# Altium schematic sheet RS232_and_USB_ports.SchDoc: RS232_and_USB_ports
size A4 portrait; Revision: 3.4; SheetNumber: 4; SheetTotal: 23; Date: 18/06/2014; DrawnBy: J. Gabriel R.E.; Organization: Seven Solutions S.L.; Address1: C/Baza, Parcela 19, Nave 3; Address2: Polнgono Ind. Juncaril; Address3: 18210-Peligros-Granada; Address4: Spain; WebAddress: www.sevensols.com; Project: White Rabbit; ProjectName: White Rabbit
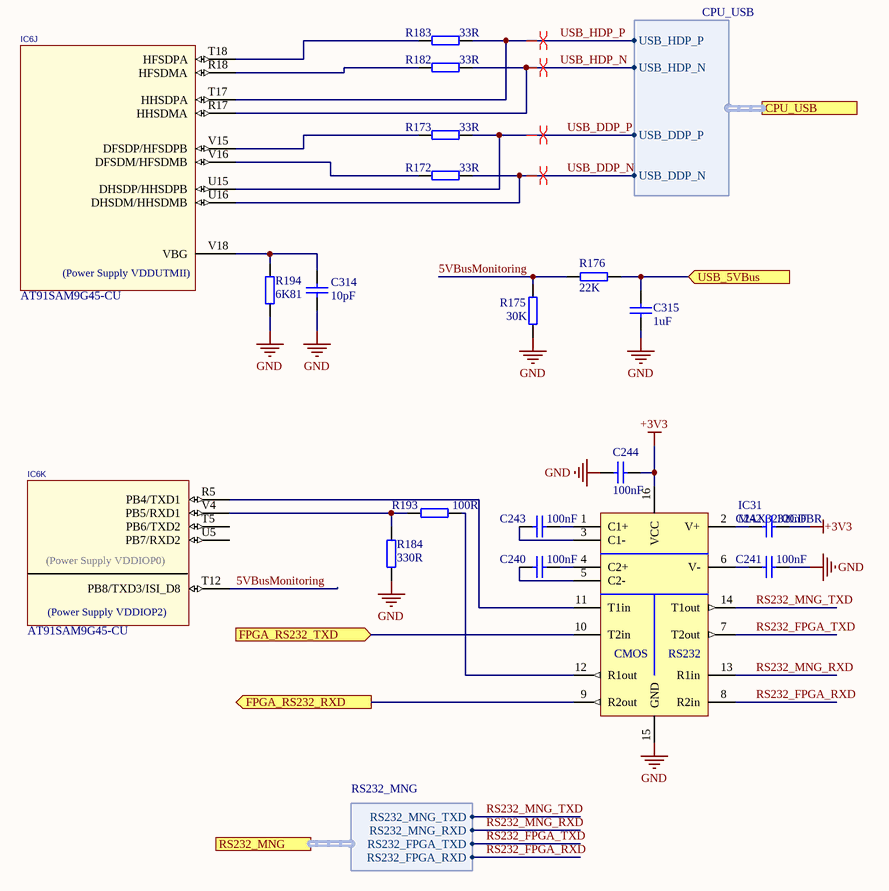
[diagram p0: RS232_and_USB_ports.SchDoc]

## Parts
C240  100nF  [CC1005-0402]
C241  100nF  [CC1005-0402]
C242  100nF  [CC1005-0402]
C243  100nF  [CC1005-0402]
C244  100nF  [CC1005-0402]
C314  10pF  [CC1005-0402]
C315  1uF  [CC1005-0402]
IC6  AT91SAM9G45-CU  [TFBGA324]  (parts J,K of 12)
IC31  MAX3232CDBR  [SOP65P780X200-16N]
R172  33R  [0603]
R173  33R  [0603]
R175  30K  [0402]
R176  22K  [0402]
R182  33R  [0603]
R183  33R  [0603]
R184  330R  [0402]
R193  100R  [0402]
R194  6K81  [0402]

## Ports
CPU_USB (harness CPU_USB), FPGA_RS232_RXD (out), FPGA_RS232_TXD (in), RS232_MNG (harness RS232_MNG), USB_5VBus (in)

## Harnesses
RS232_MNG: RS232_MNG_TXD, RS232_FPGA_TXD, RS232_MNG_RXD, RS232_FPGA_RXD
CPU_USB: USB_HDP_P, USB_HDP_N, USB_DDP_P, USB_DDP_N

## Nets
+3V3: C242.1 C244.1 IC31.16(VCC)
GND: C241.1 C244.2 C314.1 C315.2 IC31.15(GND) R175.1 R184.2 R194.1
5VBusMonitoring: IC6.T12(PB8/TXD3/ISI_D8) R175.2 R176.2
FPGA_RS232_RXD: IC31.9(R2out) ; port FPGA_RS232_RXD
FPGA_RS232_TXD: IC31.10(T2in) ; port FPGA_RS232_TXD
RS232_FPGA_RXD: IC31.8(R2in) ; port RS232_MNG.RS232_FPGA_RXD
RS232_FPGA_TXD: IC31.7(T2out) ; port RS232_MNG.RS232_FPGA_TXD
RS232_MNG_RXD: IC31.13(R1in) ; port RS232_MNG.RS232_MNG_RXD
RS232_MNG_TXD: IC31.14(T1out) ; port RS232_MNG.RS232_MNG_TXD
USB_5VBus: C315.1 R176.1 ; port USB_5VBus
USB_DDP_N: IC6.U16(DHSDM/HHSDMB) R172.2 ; port CPU_USB.USB_DDP_N
USB_DDP_P: IC6.U15(DHSDP/HHSDPB) R173.2 ; port CPU_USB.USB_DDP_P
USB_HDP_N: IC6.R17(HHSDMA) R182.2 ; port CPU_USB.USB_HDP_N
USB_HDP_P: IC6.T17(HHSDPA) R183.2 ; port CPU_USB.USB_HDP_P
NetC240_1: C240.1 IC31.4(C2+)
NetC240_2: C240.2 IC31.5(C2-)
NetC241_2: C241.2 IC31.6(V-)
NetC242_2: C242.2 IC31.2(V+)
NetC243_1: C243.1 IC31.1(C1+)
NetC243_2: C243.2 IC31.3(C1-)
NetC314_2: C314.2 IC6.V18(VBG) R194.2
NetIC6_R5: IC6.R5(PB4/TXD1) IC31.11(T1in)
NetIC6_R18: IC6.R18(HFSDMA) R182.1
NetIC6_T18: IC6.T18(HFSDPA) R183.1
NetIC6_V4: IC6.V4(PB5/RXD1) R184.1 R193.2
NetIC6_V15: IC6.V15(DFSDP/HFSDPB) R173.1
NetIC6_V16: IC6.V16(DFSDM/HFSDMB) R172.1
NetIC31_12: IC31.12(R1out) R193.1

Not connected (* = marked no-connect by the designer): IC6 T5(PB6/TXD2) U5(PB7/RXD2)

## Layout directives
differential pair: USB_DDP_N, USB_DDP_P, USB_HDP_N, USB_HDP_P

## Notes on the sheet
- Title:
- Size:
- Revision:
- A4
- Drawn by:
- Date:
- Sheet
- of
- Project:
- (in symbol AT91SAM9G45-CU, part J) (Power Supply VDDUTMII)
- (in symbol AT91SAM9G45-CU, part K) (Power Supply VDDIOP0); (Power Supply VDDIOP2)
- (in symbol IFC_MAX3232) CMOS; RS232

## Library data of the parts
C240-C244 = CC0402_100NF_16V_10%_X7R: Capacitor; Manufacturer1: TDK; Manufacturer1 PN: C1005X7R1C104K; TC: X7R; Tolerance: ±10%; Voltage: 16V; Published: 8-Jun-2000; LatestRevisionDate: 17-Jul-2002; LatestRevisionNote: Re-released for DXP Platform.; PackageReference: RAD-0.3; Publisher: Altium Limited; Distributor1: Digikey; Distributor1 PN: 445-4952-1-ND; Case: 0402; Value: 100nF
C314 = CC0402_10PF_50V_5%_NP0: Capacitor; Manufacturer1: TDK; Manufacturer1 PN: C1005C0G1H100D; TC: NPO; Tolerance: ±10%; Voltage: 50V; Published: 8-Jun-2000; LatestRevisionDate: 17-Jul-2002; LatestRevisionNote: Re-released for DXP Platform.; PackageReference: RAD-0.3; Publisher: Altium Limited; Distributor1: Digikey; Distributor1 PN: 445-1235-1-ND; Case: 0402; Value: 10pF
C315 = CC0402_1UF_16V_10%_X5R: Capacitor; Manufacturer1: TDK; Manufacturer1 PN: C1005X5R1C105K; TC: X5R; Tolerance: ±10%; Voltage: 16V; Published: 8-Jun-2000; LatestRevisionDate: 17-Jul-2002; LatestRevisionNote: Re-released for DXP Platform.; PackageReference: RAD-0.3; Publisher: Altium Limited; Distributor1: Digikey; Distributor1 PN: 445-4978-1-ND; Case: 0402; Value: 1uF
IC6 = AT91SAM9G45-CU: Atmel 400MHz ARM926 MCU; Value: AT91SAM9G45-CU; Distributor1 PN: AT91SAM9G45-CU-ND; Distributor1: Digikey
IC31 = IFC_MAX3232: Manufacturer1: Texas Instruments; Distributor1: Digikey; Distributor1 PN: 296-13093-1-ND; Manufacturer1 PN: MAX3232CDBR
R172 R173 R182 R183 = R0603_33R_±1%_0.25W_100PPM: SMD Resistor; Manufacturer1: Vishay/Dale; Manufacturer1 PN: CRCW060333R0FKEAHP; TCR: 100ppm; Power Rating: 0.25W; Tolerance: ±1%; Case: 0402; Distributor1: DigiKey; Distributor1 PN: 541-33.0SCT-ND; Value: 33R
R175 = R0402_30K_±1%_0.1W_100PPM: SMD Resistor; Manufacturer1: Panasonic; Manufacturer1 PN: ERJ-2RKF3002X; TCR: 100ppm; Power Rating: 0.1W; Tolerance: ±1%; Case: 0402; Distributor1: DigiKey; Distributor1 PN: P30.0KLCT-ND; Value: 30K
R176 = R0402_22K_±1%_0.1W_100PPM: SMD Resistor; Manufacturer1: Panasonic; Manufacturer1 PN: ERJ-2RKF2202X; TCR: 100ppm; Power Rating: 0.1W; Tolerance: ±1%; Case: 0402; Distributor1: DigiKey; Distributor1 PN: P22.0KLCT-ND; Value: 22K
R184 = R0402_330R_±1%_0.1W_100PPM: SMD Resistor; Manufacturer1: Panasonic; Manufacturer1 PN: ERJ-2RKF3300X; TCR: 100ppm; Power Rating: 0.1W; Tolerance: ±1%; Case: 0402; Distributor1: DigiKey; Distributor1 PN: P330LCT-ND; Value: 330R
R193 = R0402_100R_±1%_0.1W_100PPM: SMD Resistor; Manufacturer1: Panasonic; Manufacturer1 PN: ERJ-2RKF1000X; TCR: 100ppm; Power Rating: 0.1W; Tolerance: ±1%; Case: 0402; Distributor1: DigiKey; Distributor1 PN: P100LCT-ND; Value: 100R
R194 = R0402_6K81_±1%_0.1W_100PPM: SMD Resistor; Manufacturer1: Panasonic; Manufacturer1 PN: ERJ-2RKF6811X; TCR: 100ppm; Power Rating: 0.1W; Tolerance: ±1%; Case: 0402; Distributor1: DigiKey; Distributor1 PN: P6.81KLCT-ND; Value: 6K81